# Altium schematic sheet schematics.SchDoc
size A4; SheetNumber: 1; SheetTotal: 1
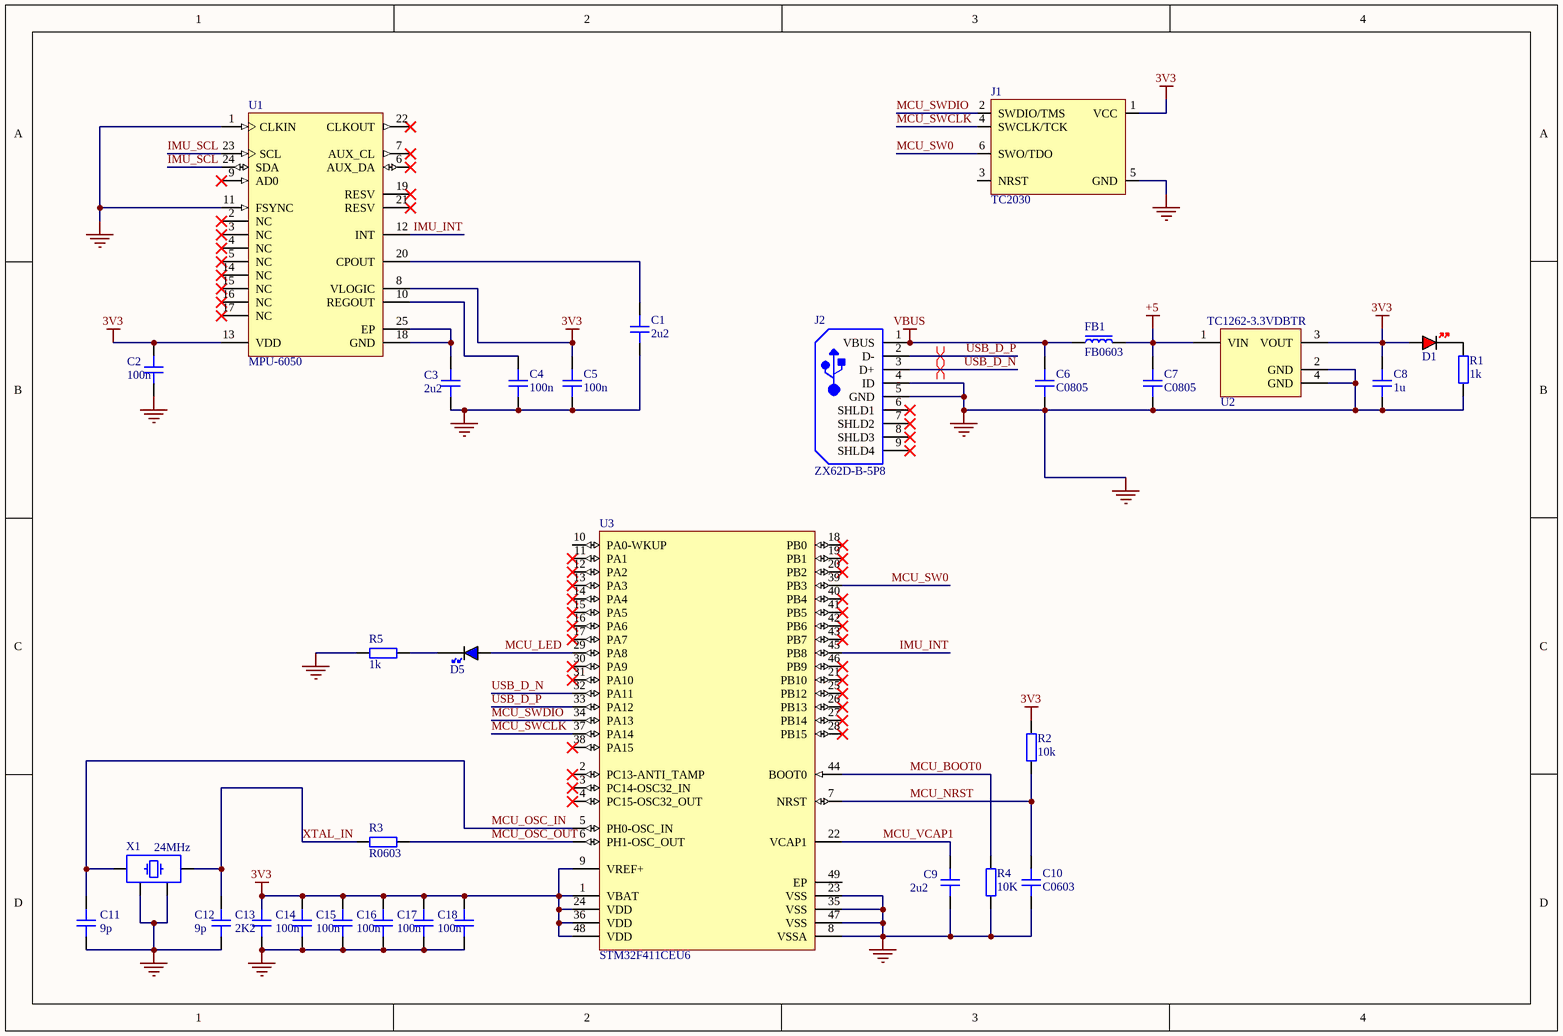
[diagram p0: schematics.SchDoc]

## Parts
C1  2u2  [CAP_0603]
C2  100n  [CAP_0603]
C3  2u2  [CAP_0603]
C4  100n  [CAP_0603]
C5  100n  [CAP_0603]
C6  C0805  [CAP_0805]
C7  C0805  [CAP_0805]
C8  1u  [CAP_0603]
C9  2u2  [CAP_0603]
C10  C0603  [CAP_0603]
C11  9p  [CAP_0603]
C12  9p  [CAP_0603]
C13  2K2  [CAP_0603]
C14  100n  [CAP_0603]
C15  100n  [CAP_0603]
C16  100n  [CAP_0603]
C17  100n  [CAP_0603]
C18  100n  [CAP_0603]
D1  RED  [LED_0402_RED]  (value not drawn)
D5  BLUE  [LED_0402_BLUE]  (value not drawn)
FB1  FB0603  [FB_0603]
J1  TC2030  [TC2030-FP]  (no BOM)
J2  ZX62D-B-5P8  [HIRO-ZX62D-B-5P8_V]
R1  1k  [RES_0603]
R2  10k  [RES_0603]
R3  R0603  [RES_0603]
R4  10K  [RES_0603]
R5  1k  [RES_0603]
U1  MPU-6050  [IS-QFN-24_V]
U2  TC1262-3.3VDBTR  [SOT-223-DB3_N]
U3  STM32F411CEU6  [STM-UFQFPN48_L]
X1  24MHz  [XTAL_3225]

## Nets
3V3: C2.2 C5.2 C8.2 C13.2 C14.2 C15.2 C16.2 C17.2 C18.2 D1.A J1.1(VCC) R2.1 U1.8(VLOGIC) U1.13(VDD) U2.3(VOUT) U3.1(VBAT) U3.9(VREF+) U3.24(VDD) U3.36(VDD) U3.48(VDD)
+5: C7.2 FB1.2 U2.1(VIN)
GND: C1.2 C2.1 C3.1 C4.1 C5.1 C6.1 C7.1 C8.1 C9.1 C10.1 C11.1 C12.1 C13.1 C14.1 C15.1 C16.1 C17.1 C18.1 J1.5(GND) J2.4(ID) J2.5(GND) R1.1 R4.2 R5.2 U1.1(CLKIN) U1.11(FSYNC) U2.2(GND) U2.4(GND) U3.8(VSSA) U3.23(VSS) U3.35(VSS) U3.47(VSS) X1.2 X1.4
VBUS: C6.2 FB1.1 J2.1(VBUS)
IMU_INT: U1.12(INT) U3.45(PB8)
IMU_SCL: U1.23(SCL) U1.24(SDA)
MCU_BOOT0: R4.1 U3.44(BOOT0)
MCU_LED: D5.A U3.29(PA8)
MCU_NRST: C10.2 R2.2 U3.7(NRST)
MCU_OSC_IN: C11.2 U3.5(PH0-OSC_IN) X1.1
MCU_OSC_OUT: R3.2 U3.6(PH1-OSC_OUT)
MCU_SW0: J1.6(SWO/TDO) U3.39(PB3)
MCU_SWCLK: J1.4(SWCLK/TCK) U3.37(PA14)
MCU_SWDIO: J1.2(SWDIO/TMS) U3.34(PA13)
MCU_VCAP1: C9.2 U3.22(VCAP1)
USB_D_N: J2.3(D+) U3.32(PA11)
USB_D_P: J2.2(D-) U3.33(PA12)
XTAL_IN: C12.2 R3.1 X1.3
NetC1_1: C1.1 U1.20(CPOUT)
NetC3_2: C3.2 U1.18(GND) U1.25(EP)
NetC4_2: C4.2 U1.10(REGOUT)
NetD1_K: D1.K R1.2
NetD5_K: D5.K R5.1

Not connected (* = marked no-connect by the designer): J1 3(NRST); J2 6(SHLD1)* 7(SHLD2)* 8(SHLD3)* 9(SHLD4)*; U1 2(NC)* 3(NC)* 4(NC)* 5(NC)* 6(AUX_DA)* 7(AUX_CL)* 9(AD0)* 14(NC)* 15(NC)* 16(NC)* 17(NC)* 19(RESV)* 21(RESV)* 22(CLKOUT)*; U3 2(PC13-ANTI_TAMP)* 3(PC14-OSC32_IN)* 4(PC15-OSC32_OUT)* 10(PA0-WKUP) 11(PA1)* 12(PA2)* 13(PA3)* 14(PA4)* 15(PA5)* 16(PA6)* 17(PA7)* 18(PB0)* 19(PB1)* 20(PB2)* 21(PB10)* 25(PB12)* 26(PB13)* 27(PB14)* 28(PB15)* 30(PA9)* 31(PA10)* 38(PA15)* 40(PB4)* 41(PB5)* 42(PB6)* 43(PB7)* 46(PB9)* 49(EP)

## Layout directives
differential pair: USB_D_N, USB_D_P

## Library data of the parts
C1-C5 C8-C10 C13-C18 = CAP_0603: Capacitor SMD 0603; Manufacturer: *; Manufacturer Part Number: *; Distributor Link: *; LCSC: *; Rating: *; Dielectric: *
C6 C7 = CAP_0805: Capacitor SMD 0805; Manufacturer: *; Manufacturer Part Number: *; Distributor Link: *; LCSC: *; Rating: *; Dielectric: *
C11 C12 = CAP_0603: Capacitor SMD 0603; Manufacturer: Seiko Epson; Manufacturer Part Number: X1E0000210127; Distributor Link: *; LCSC: *; Rating: *; Dielectric: *
D1 = LED_0402_RED: LED 0402 RED SMD
D5 = LED_0402_BLUE: LED 0402 BLUE SMD
FB1 = FB_0603: Ferrite Bead SMD 0603; Manufacturer: *; Manufacturer Part Number: *; Distributor Link: *; LCSC: *
J1 = TC2030: Tag-Connect No-Solder SWD Debug Connector DO NOT PLACE; Manufacturer: Tag-Connect; Manufacturer Part Number: TC2030
J2 = CMP-002-00043-2: Right Angle Receptacle Connector, Micro USB, 5 Position, Height 2.65 mm, -30 to 85 degC, RoHS, Tape and Reel; Manufacturer: Hirose Electric; Gender: Male; Rows: 1; Current Rating: 1A; Max Operating Temperature: 85°C; Package Quantity: 2000; Connector Type: USB; Datasheet Version: Aug-16; Contact Material: Copper; Packaging: TapeandReel; Package URL: https://www.hirose.com/product/en/download_file/key_name/ZX62D-B-5P8/category/Drawing%20(2D)/doc_file_id/36535/?file_category_id=6&item_id=02420034000&is_series=; Min Operating Temperature: -30°C; Case/Package: ZX62D-B-5P8; Package Reference: ZX62D-B-5P8; Pins: 5; Mounting Technology: SM; Package Description: USB Connector, 5 Position Surface Mount, Length 8 mm, Height 2.65 mm; Housing Material: Plastic; Datasheet URL: https://www.hirose.com/product/en/download_file/key_name/ZX62D-B-5P8/category/Catalog/doc_file_id/31704/?file_category_id=5&item_id=02420034000&is_series=; Contact Plating: Gold; Lead Pitch: 0.65mm; RoHS Compliant: True; Manufacturer URL: https://www.hirose.com
R1-R5 = RES_0603: Resistor SMD 0603; Manufacturer: *; Manufacturer Part Number: *; Distributor Link: *; LCSC: *
U1 = CMP-1753-00002-2: 3-Axis Gyroscope, Accelerometer and a Digital Motion Processor(TM) (DMP), 2.375 to 3.46 V, -40 to 85 degC, 24-Pin QFN, RoHS, Tape and Reel; Manufacturer: InvenSense; Featured Product: MPU-60506-Axis,IntegratedI²CSolution; Other Names: 1428-1007-2 / MPU6050; Sensor Type: MotionTracking; Online Catalog: MPU-6000™Series; Unit PriceUSD: Digital; Datasheet Version: Rev. 3.3, 05/2012; Category: Sensors,Transducers; Datasheet URL: http://datasheet.octopart.com/MPU-6050-InvenSense-datasheet-14421344.pdf; Family: Multifunction; Standard Package: 5,000; Manufacturer URL: http://www.invensense.com/; Output Type: Digital; Dynamic Catalog: MPU-6000™Series
U2 = CMP-0136-00481-1: 500mA Fixed Output CMOS LDO, 3-Pin SOT-223, Extended Temperature, Tape and Reel; PackageVersion: revBB, Aug-2009; PackageDescription: 3-Lead Plastic Small Outline Transistor (DB) [SOT-223]; DatasheetVersion: revB, 2002; PackageReference: SOT-223-DB3
U3 = CMP-0243-00165-1: ARM Cortex-M4 32-bit MCU+FPU, 512 KB Flash, 128 KB RAM, 36 I/Os, 48-Pin UFQFPN, -40 to 85 degC, Tray; Operating Frequency(F) (Processor speed) (MHz): 100; FLASH Size (Prog) (kB): 512; Internal RAM Size (kB): 128; I/Os (High Current): 36; Supply Voltage(Vcc) min (V): 1.7; Package Reference: 48-Pin Ultra Thin Fine Pitch Quad Flat No-Lead, 7 x 7 x 0.6 mm Body, 0.5 mm Pitch, Exposed Pad; ComponentLink1Description: Manufacturer URL; ComponentLink1URL: http://www.st.com/; Packing: Tray; Package Description: UFQFPN48; Core: ARM Cortex-M4; ComponentLink2Description: Datasheet; ComponentLink2URL: http://www.st.com/st-web-ui/static/active/en/resource/technical/document/datasheet/DM00115249.pdf; DatasheetVersion: Rev. 6; Mounting Technology: Surface Mount
X1 = TSX-3225_24.0000MF15X-AC: Crystal SMD 24MHz 10PPM 7pF 3225; Manufacturer: Epson; Manufacturer Part Number: TSX-3225 24.0000MF15X-AC